# Altium schematic sheet 1-Top.SchDoc
size 420 x 297 mm; SheetNumber: 1; SheetTotal: 10; PageSetup: Record=PageOptions|CenterHorizontal=True|CenterVertical=True|PrintScale=0.96|XCorrection=1.00|YCorrection=1.00|PrintKind=1|BorderSize=5000000|LeftOffset=0|BottomOffset=0|Orientation=2|PaperLength=4318|PaperWidth=2794|Scale=100|PaperSource=7|PrintQuality=600|MediaType=1|DitherType=10|PaperKind=11" x 17"|PrintScaleMode=1
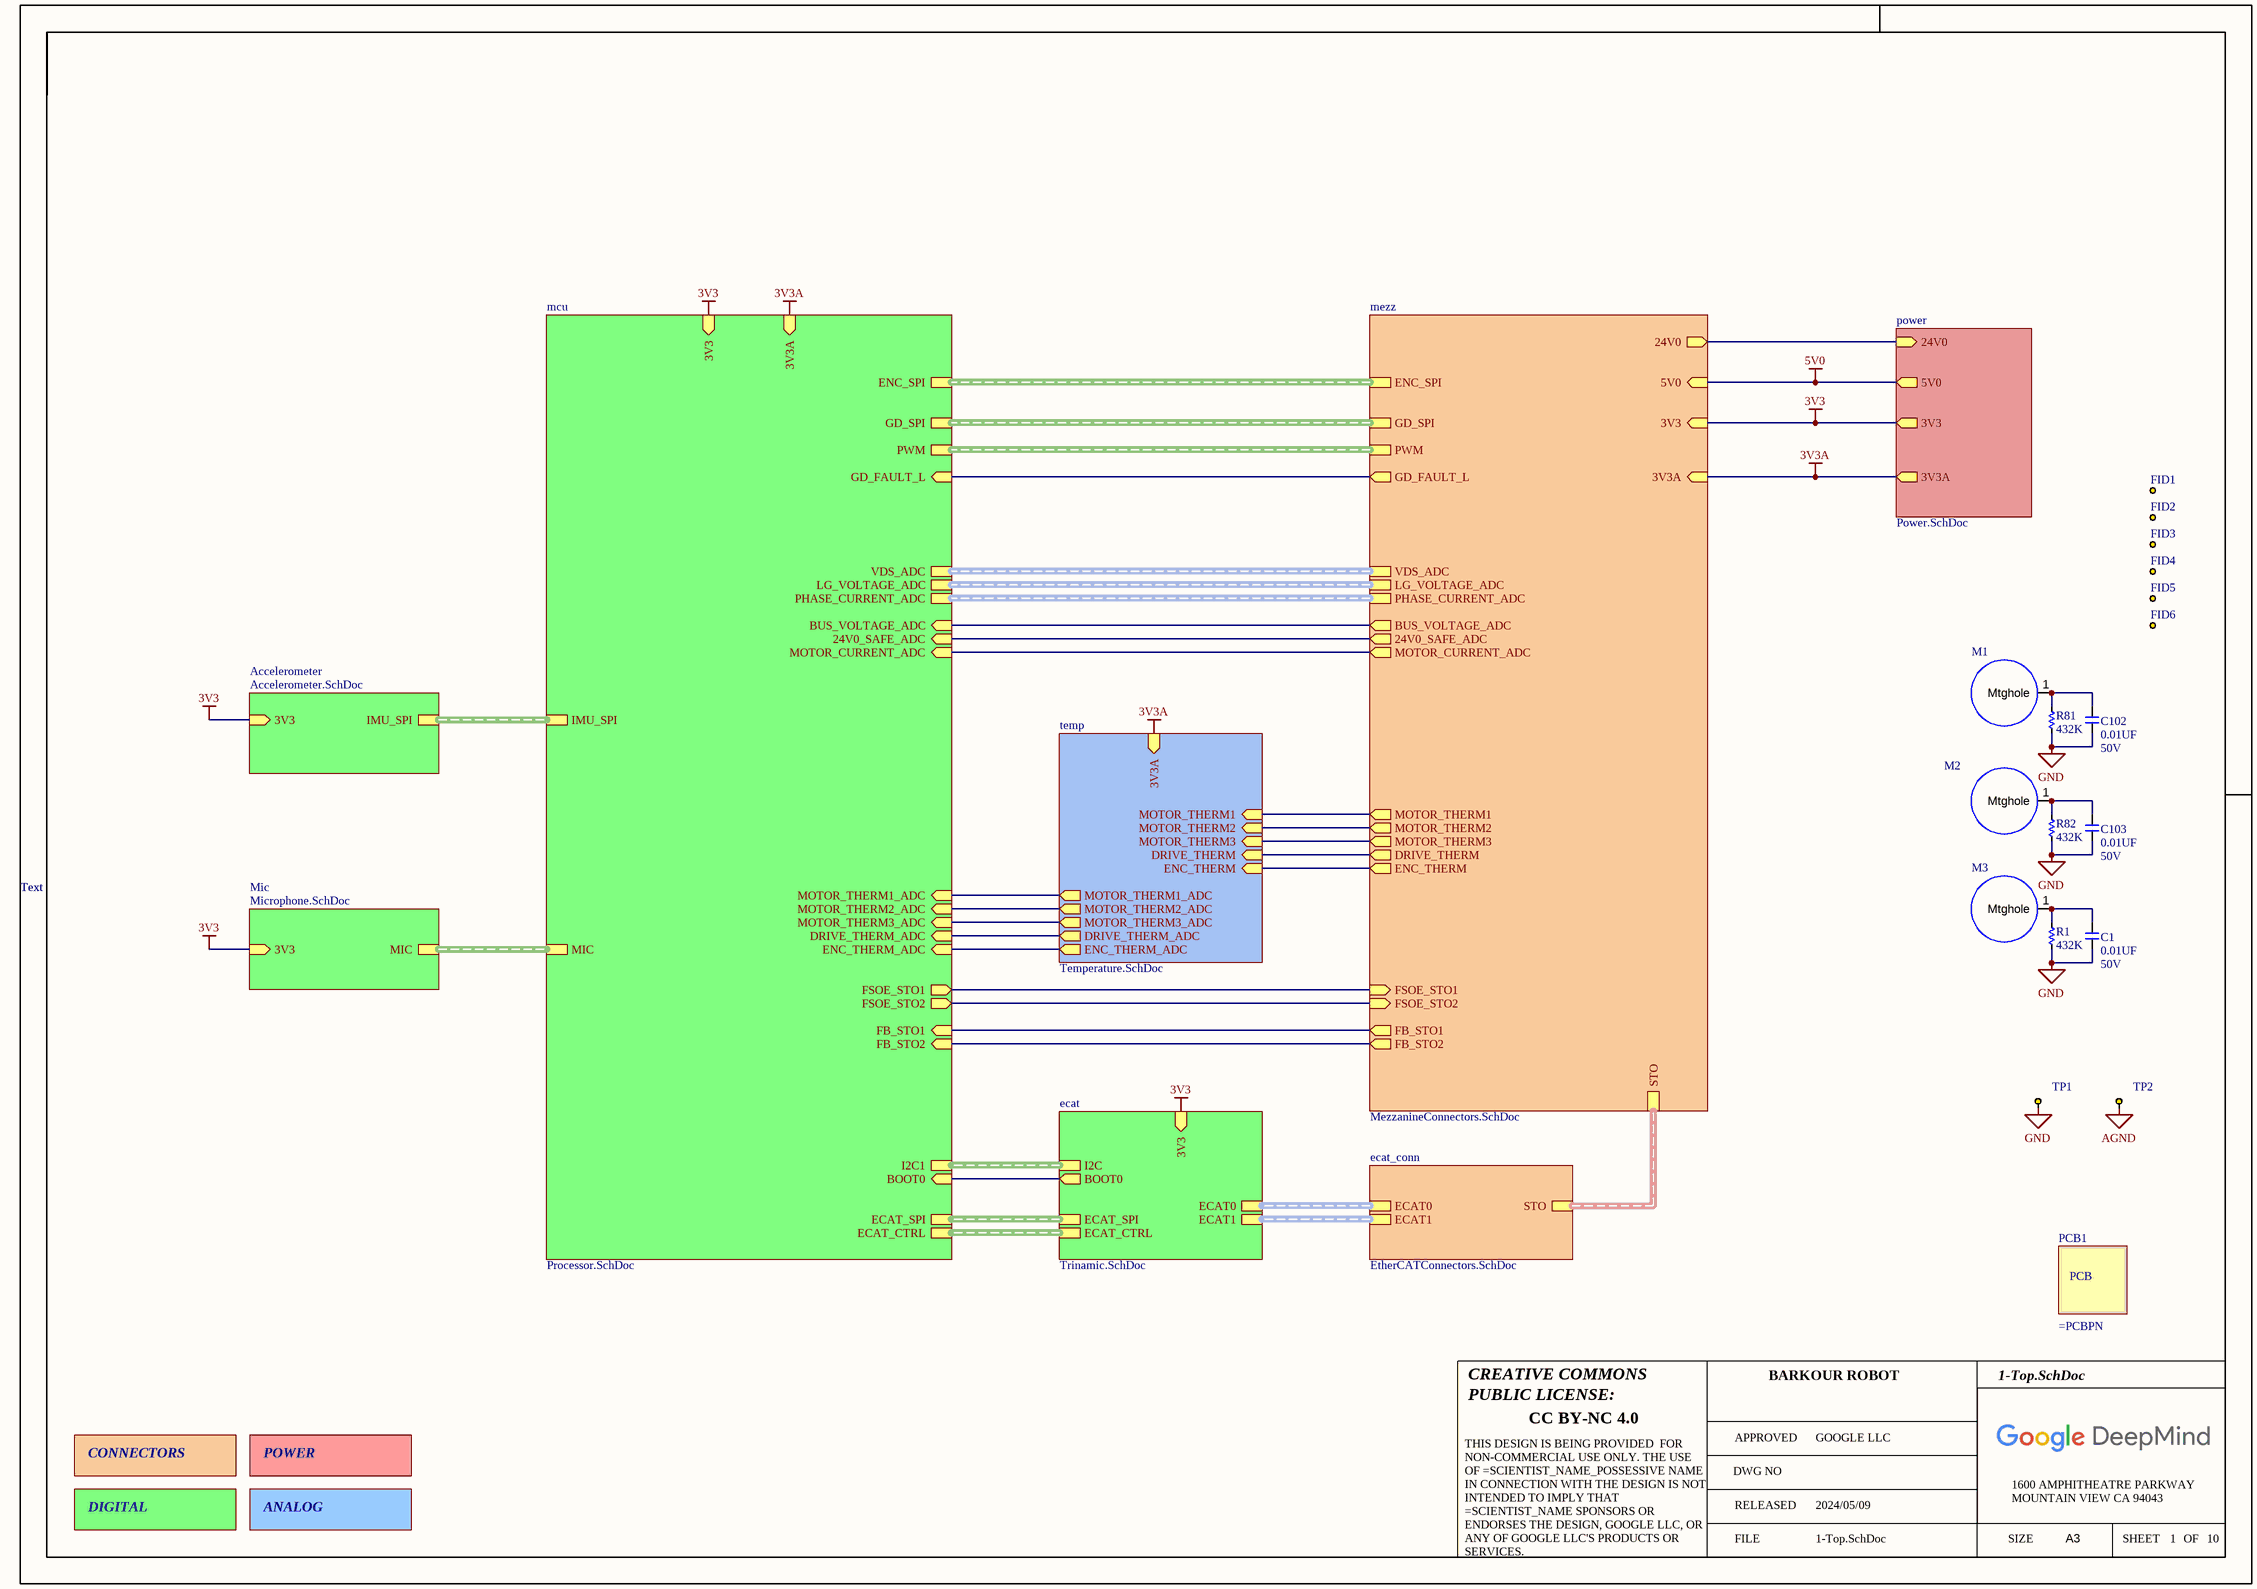
[diagram p0: 1-Top.SchDoc]

## Parts
C1  value 0.01UF  Voltage: 50V  [C0402]  (hidden comment: __Template_Cap)
C102  value 0.01UF  Voltage: 50V  [C0402]  (hidden comment: __Template_Cap)
C103  value 0.01UF  Voltage: 50V  [C0402]  (hidden comment: __Template_Cap)
FID1  FIDUCIAL  [FIDUCIAL_1MM]  (value not drawn)  (no BOM)
FID2  FIDUCIAL  [FIDUCIAL_1MM]  (value not drawn)  (no BOM)
FID3  FIDUCIAL  [FIDUCIAL_1MM]  (value not drawn)  (no BOM)
FID4  FIDUCIAL  [FIDUCIAL_1MM]  (value not drawn)  (no BOM)
FID5  FIDUCIAL  [FIDUCIAL_1MM]  (value not drawn)  (no BOM)
FID6  FIDUCIAL  [FIDUCIAL_1MM]  (value not drawn)  (no BOM)
M1  3.7mm hole 5mm pad  [3.7hole5pad]  (value not drawn)
M2  3.7mm hole 5mm pad  [3.7hole5pad]  (value not drawn)
M3  3.7mm hole 5mm pad  [3.7hole5pad]  (value not drawn)
PCB1  PCB  (value not drawn)  (mechanical)
R1  value 432K  [R0805]
R81  value 432K  [R0805]
R82  value 432K  [R0805]
TP1  TEST_KEYSTONE5001  [TP_KEYSTONE_5001]  (value not drawn)
TP2  TEST_KEYSTONE5001  [TP_KEYSTONE_5001]  (value not drawn)

## Sub-sheets
Accelerometer = Accelerometer.SchDoc: IMU_SPI (harness SPI_AGM), 3V3 (in)
ecat = Trinamic.SchDoc: ECAT_SPI (harness SPI), ECAT_CTRL (harness Ethercat_Control), 3V3 (in), ECAT0 (harness ECAT), ECAT1 (harness ECAT), I2C (harness I2C), BOOT0 (out)
ecat_conn = EtherCATConnectors.SchDoc: ECAT0 (harness ECAT), STO (harness STO), ECAT1 (harness ECAT)
mcu = Processor.SchDoc: ENC_SPI (harness SPI), IMU_SPI (harness SPI_AGM), MIC (harness PDM), 3V3 (in), 3V3A (in), PWM (harness PWM), GD_SPI (harness SPI), GD_FAULT_L (in), VDS_ADC (harness Phases), LG_VOLTAGE_ADC (harness Phases), PHASE_CURRENT_ADC (harness Phases), MOTOR_CURRENT_ADC (in), 24V0_SAFE_ADC (in), BUS_VOLTAGE_ADC (in), MOTOR_THERM1_ADC (in), MOTOR_THERM2_ADC (in), MOTOR_THERM3_ADC (in), DRIVE_THERM_ADC (in), ECAT_SPI (harness SPI), ECAT_CTRL (harness Ethercat_Control), ENC_THERM_ADC (in), FSOE_STO2 (out), FB_STO1 (in), FB_STO2 (in), FSOE_STO1 (out), I2C1 (harness I2C), BOOT0 (in)
mezz = MezzanineConnectors.SchDoc: 24V0 (out), 3V3A (in), MOTOR_THERM1 (out), MOTOR_THERM2 (out), MOTOR_THERM3 (out), VDS_ADC (harness Phases), LG_VOLTAGE_ADC (harness Phases), MOTOR_CURRENT_ADC (out), 24V0_SAFE_ADC (out), PHASE_CURRENT_ADC (harness Phases), BUS_VOLTAGE_ADC (out), DRIVE_THERM (out), PWM (harness PWM), GD_SPI (harness SPI), FSOE_STO2 (in), FB_STO1 (out), FB_STO2 (out), FSOE_STO1 (in), GD_FAULT_L (out), 3V3 (in), STO (harness STO), ENC_SPI (harness SPI), ENC_THERM (out), 5V0 (in)
Mic = Microphone.SchDoc: MIC (harness PDM), 3V3 (in)
power = Power.SchDoc: 24V0 (in), 5V0 (out), 3V3 (out), 3V3A (out)
temp = Temperature.SchDoc: 3V3A (in), MOTOR_THERM1 (in), MOTOR_THERM2 (in), MOTOR_THERM3 (in), DRIVE_THERM (in), MOTOR_THERM1_ADC (out), MOTOR_THERM2_ADC (out), MOTOR_THERM3_ADC (out), DRIVE_THERM_ADC (out), ENC_THERM (in), ENC_THERM_ADC (out)

## Nets
3V3: sheet mcu/3V3, sheet Accelerometer/3V3, sheet ecat/3V3, sheet power/3V3, sheet Mic/3V3, sheet mezz/3V3
3V3A: sheet mcu/3V3A, sheet power/3V3A, sheet temp/3V3A, sheet mezz/3V3A
5V0: sheet power/5V0, sheet mezz/5V0
AGND: TP2.1
GND: C1.2 C102.2 C103.2 R1.1 R81.1 R82.1 TP1.1
NetC1_1: C1.1 M3.1(Mtghole) R1.2
NetC102_1: C102.1 M1.1(Mtghole) R81.2
NetC103_1: C103.1 M2.1(Mtghole) R82.2
(unnamed): sheet mcu/GD_FAULT_L, sheet mezz/GD_FAULT_L
(unnamed): sheet mcu/MOTOR_CURRENT_ADC, sheet mezz/MOTOR_CURRENT_ADC
(unnamed): sheet mcu/24V0_SAFE_ADC, sheet mezz/24V0_SAFE_ADC
(unnamed): sheet mcu/BUS_VOLTAGE_ADC, sheet mezz/BUS_VOLTAGE_ADC
(unnamed): sheet mcu/MOTOR_THERM1_ADC, sheet temp/MOTOR_THERM1_ADC
(unnamed): sheet mcu/MOTOR_THERM2_ADC, sheet temp/MOTOR_THERM2_ADC
(unnamed): sheet mcu/MOTOR_THERM3_ADC, sheet temp/MOTOR_THERM3_ADC
(unnamed): sheet mcu/DRIVE_THERM_ADC, sheet temp/DRIVE_THERM_ADC
(unnamed): sheet mcu/ENC_THERM_ADC, sheet temp/ENC_THERM_ADC
(unnamed): sheet mcu/FSOE_STO2, sheet mezz/FSOE_STO2
(unnamed): sheet mcu/FB_STO1, sheet mezz/FB_STO1
(unnamed): sheet mcu/FB_STO2, sheet mezz/FB_STO2
(unnamed): sheet mcu/FSOE_STO1, sheet mezz/FSOE_STO1
(unnamed): sheet mcu/BOOT0, sheet ecat/BOOT0
(unnamed): sheet power/24V0, sheet mezz/24V0
(unnamed): sheet temp/MOTOR_THERM1, sheet mezz/MOTOR_THERM1
(unnamed): sheet temp/MOTOR_THERM2, sheet mezz/MOTOR_THERM2
(unnamed): sheet temp/MOTOR_THERM3, sheet mezz/MOTOR_THERM3
(unnamed): sheet temp/DRIVE_THERM, sheet mezz/DRIVE_THERM
(unnamed): sheet temp/ENC_THERM, sheet mezz/ENC_THERM

## Buses and harness runs
harness sheet Accelerometer/IMU_SPI = sheet mcu/IMU_SPI
harness sheet ecat/ECAT0 = sheet ecat_conn/ECAT0
harness sheet ecat/ECAT1 = sheet ecat_conn/ECAT1
harness sheet ecat/ECAT_CTRL = sheet mcu/ECAT_CTRL
harness sheet ecat/ECAT_SPI = sheet mcu/ECAT_SPI
harness sheet ecat/I2C = sheet mcu/I2C1
harness sheet ecat_conn/STO = sheet mezz/STO
harness sheet mcu/ENC_SPI = sheet mezz/ENC_SPI
harness sheet mcu/GD_SPI = sheet mezz/GD_SPI
harness sheet mcu/LG_VOLTAGE_ADC = sheet mezz/LG_VOLTAGE_ADC
harness sheet mcu/MIC = sheet Mic/MIC
harness sheet mcu/PHASE_CURRENT_ADC = sheet mezz/PHASE_CURRENT_ADC
harness sheet mcu/PWM = sheet mezz/PWM
harness sheet mcu/VDS_ADC = sheet mezz/VDS_ADC

## Notes on the sheet
- Text
- CONNECTORS
- POWER
- DIGITAL
- ANALOG
- CREATIVE COMMONS
- PUBLIC LICENSE:
- BARKOUR ROBOT
- CC BY-NC 4.0
- APPROVED
- DWG NO
- GOOGLE LLC
- FILE
- RELEASED
- 2024/05/09
- SIZE
- 1600 AMPHITHEATRE PARKWAY
- MOUNTAIN VIEW CA 94043
- A3
- SHEET
- OF
- THIS DESIGN IS BEING PROVIDED  FOR NON-COMMERCIAL USE ONLY. THE USE OF =SCIENTIST_NAME_POSSESSIVE NAME IN CONNECTION WITH THE DESIGN IS NOT INTENDED TO IMPLY THAT =SCIENTIST_NAME SPONSORS OR ENDORSES THE DESIGN, GOOGLE LLC, OR ANY OF GOOGLE LLC'S PRODUCTS OR SERVICES.

## Library data of the parts
C1 C102 C103 = 625: CAP, CER, X7R, 0.01uF, 50V, 20%, 0402, 0.56mm T; ID: 625; MFG: KEMET; MFG P/N: C0402C103M5RACTU; XPN: 150-00227-00; EES: 150-04592-00; Status: Released; Package: 0402; Dielectric: X7R; Tolerance: 20%; Height: 0.56mm T; ComponentLink1Description: Datasheet; COMMON: 150-00227-00; LOON: 150-00227-00; Gecko: 150-00227-00
FID1-FID6 = 93: FIDUCIAL 1MM COPPER CIRCLE 3MM MASK PULLBACK; ID: 93; MFG: _PCB Feature; Status: In Development
M1-M3 = MtgHole
PCB1 = 110: ID: 110; Level: 1; FindNumber: 010; Org: ORG - REP; Type: PCB; GPN: =PCBPN; Status: In Development; MFG P/N: =PCBPN; PROXY: =PCBPN; Type: 651-PCB; ItemNumber: =PCBPN; ProductLine: Proxy
R1 R81 R82 = 5492: Resistor, 432K Ohms, 0805, 0.125W, ±1%; ID: 5492; MFG: YAGEO; MFG P/N: RC0805FR-07432KL; Power: 1/8W; COMMON: 470-08723-00; XPN: XS-10019230; EES: 470-17987-00; Status: Released; Package: 0805; Tolerance: 1%; Height: 0.60mm; Supplier 1: Digi-Key; LOON: 470-08723-00; Gecko: 470-08723-00; Supplier Part Number 1: 311-432KCRCT-ND
TP1 TP2 = TEST_KEYSTONE5001: PC TEST POINT TH RING; Manufacturer: Keystone Electronics; Manufacturer Part Number: 5001; Part Number: 250-00184-00; Supplier 1: Digi-Key; Supplier Part Number 1: 5001K-ND; RoHS: RoHS Compliant; Category: Test and Measurement; Stock 1: 341830; Pricing 1: 1=0.33, 10=0.309, 50=0.2252, 100=0.2164, 250=0.19432, 500=0.18548, 1000=0.15456, 2500=0.14131, 5000=0.13248 (USD); Packaging: Bulk; Type: PC Test Point, Miniature; Terminal: 0.010" x 0.020" (0.25mm x 0.51mm) Phosphor Bronze Wire, Silver Plate; Mounting Type: 0.040" (1.02mm) Hole Diameter; Material: Base, Nylon 46, UL 94V-0; Color: Black; ComponentLink1URL: http://www.keyelco.com/product-pdf.cfm?p=1310; ComponentLink1Description: http://www.keyelco.com/product-pdf.cfm?p=1310